# EAGLE design Prototipo_2X_DobleCapa (EAGLE 6.1)
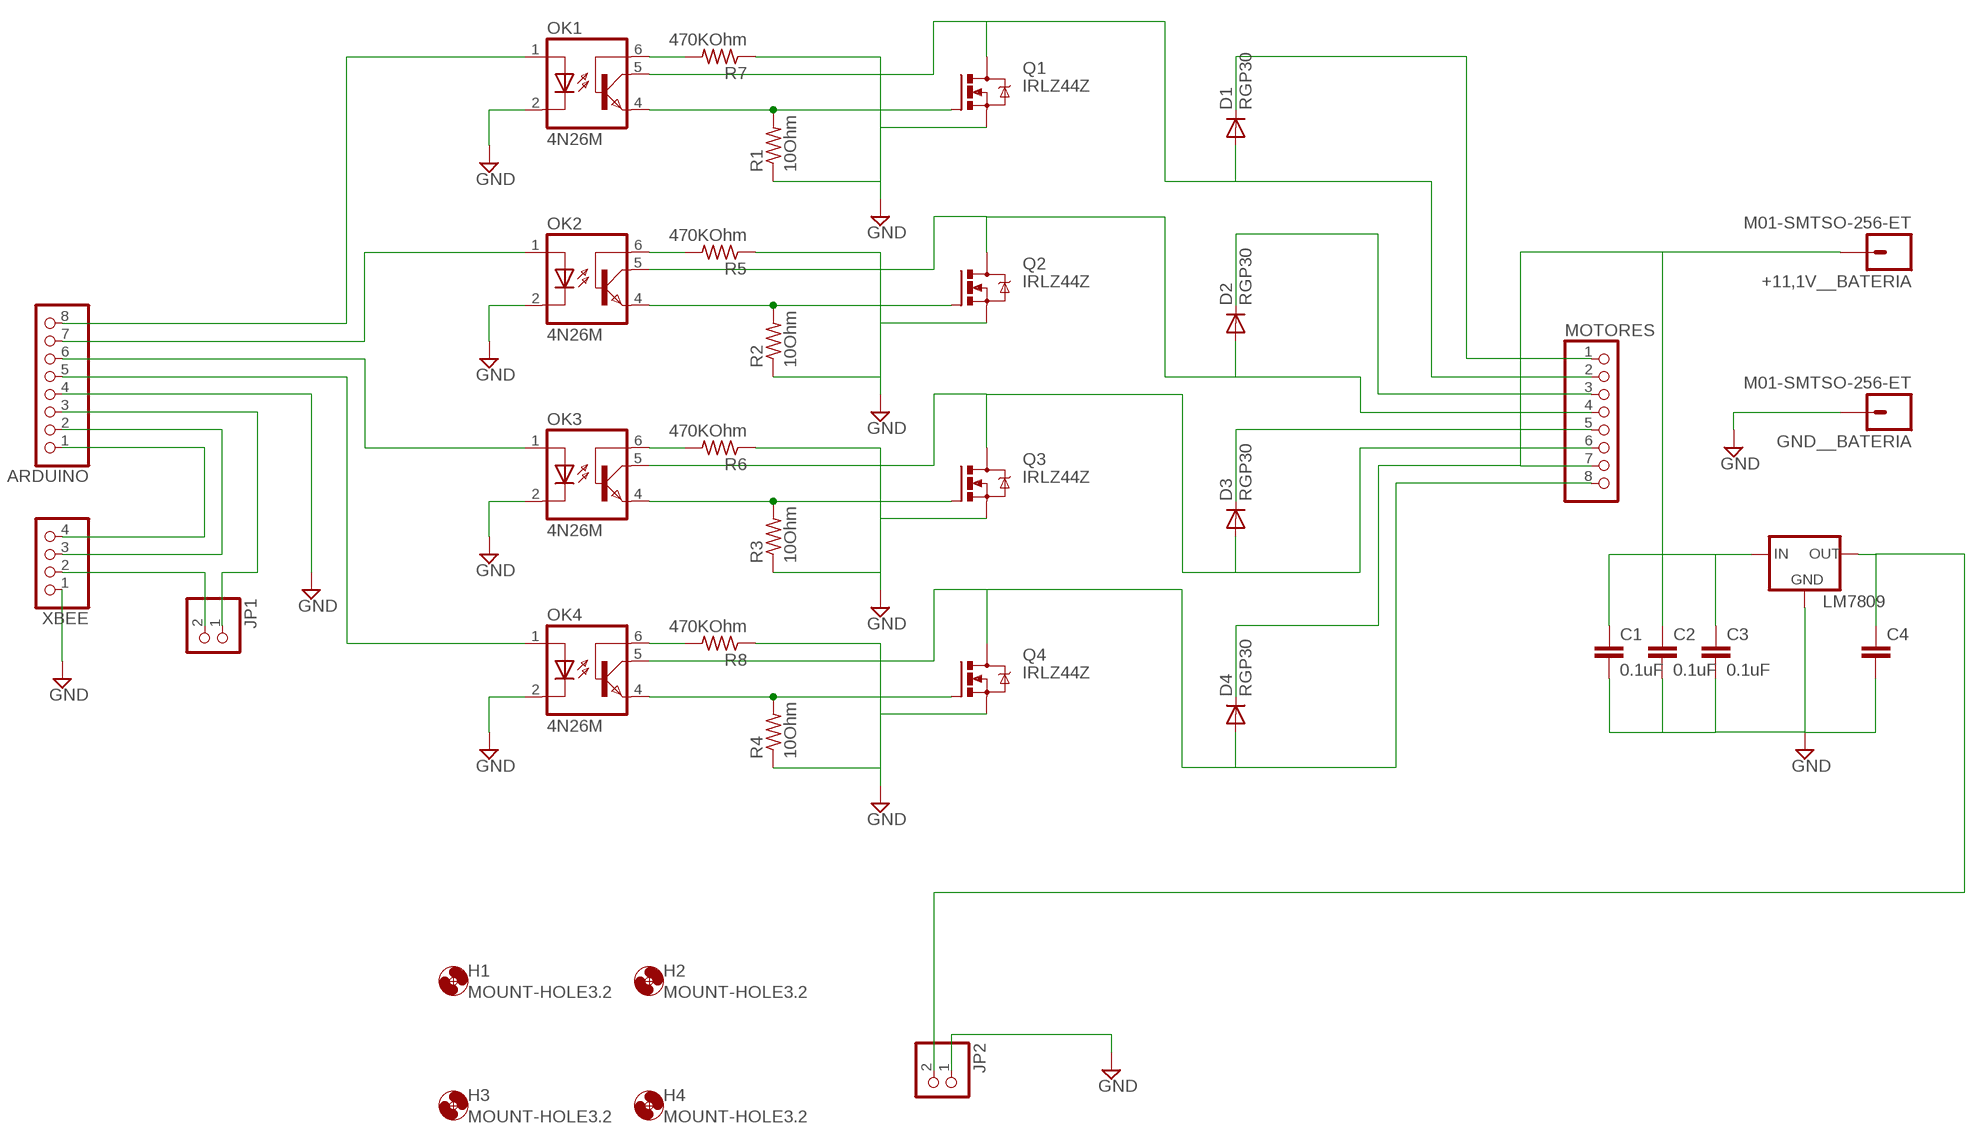
[diagram p0: schematic, sheet 1]

## Parts
+11,1V__BATERIA  M01-SMTSO-256-ET  [SMTSO-256-ET]
ARDUINO  PINHD-1X8/90  [1X08/90]
C1  0.1uF  0.1UF-50V-20%(PTH)KIT-EZ  [CAP-PTH-SMALL-KIT]
C2  0.1uF  0.1UF-50V-20%(PTH)KIT-EZ  [CAP-PTH-SMALL-KIT]
C3  0.1uF  0.1UF-50V-20%(PTH)KIT-EZ  [CAP-PTH-SMALL-KIT]
C4  0.1UF-50V-20%(PTH)KIT-EZ  [CAP-PTH-SMALL-KIT]
D1  RGP30  [DO201-15]
D2  RGP30  [DO201-15]
D3  RGP30  [DO201-15]
D4  RGP30  [DO201-15]
GND__BATERIA  M01-SMTSO-256-ET  [SMTSO-256-ET]
H1  MOUNT-HOLE3.2  [3,2]
H2  MOUNT-HOLE3.2  [3,2]
H3  MOUNT-HOLE3.2  [3,2]
H4  MOUNT-HOLE3.2  [3,2]
JP1  PINHD-1X2  [1X02]
JP2  PINHD-1X2/90  [1X02/90]
LM7809  78XXL  [78XXL]
MOTORES  PINHD-1X8/90  [1X08/90]
OK1  4N26M  [DIL06]
OK2  4N26M  [DIL06]
OK3  4N26M  [DIL06]
OK4  4N26M  [DIL06]
Q1  IRLZ44Z  [TO220BH]
Q2  IRLZ44Z  [TO220BH]
Q3  IRLZ44Z  [TO220BH]
Q4  IRLZ44Z  [TO220BH]
R1  10Ohm  R-US_0207/7  [0207/7]
R2  10Ohm  R-US_0207/7  [0207/7]
R3  10Ohm  R-US_0207/7  [0207/7]
R4  10Ohm  R-US_0207/7  [0207/7]
R5  470KOhm  R-US_0207/7  [0207/7]
R6  470KOhm  R-US_0207/7  [0207/7]
R7  470KOhm  R-US_0207/7  [0207/7]
R8  470KOhm  R-US_0207/7  [0207/7]
XBEE  PINHD-1X4  [1X04]

## Nets
GND [power]: ARDUINO.4 C1.2 C2.2 C3.2 C4.2 GND__BATERIA.P$1 JP2.1 LM7809.GND OK1.2(C) OK2.2(C) OK3.2(C) OK4.2(C) Q1.S Q2.S Q3.S Q4.S R1.1 R2.1 R3.1 R4.1 R5.1 R6.1 R7.1 R8.1 XBEE.1
N$1: ARDUINO.8 OK1.1(A)
N$2: ARDUINO.7 OK2.1(A)
N$3: ARDUINO.6 OK3.1(A)
N$4: ARDUINO.5 OK4.1(A)
N$5: ARDUINO.1 XBEE.4
N$6: OK1.6(BAS) R7.2
N$7: JP1.2 XBEE.2
N$8: OK1.4(EMI) Q1.G R1.2
N$9: OK2.4(EMI) Q2.G R2.2
N$10: OK3.4(EMI) Q3.G R3.2
N$11: OK4.4(EMI) Q4.G R4.2
N$12: +11,1V__BATERIA.P$1 C1.1 C2.1 C3.1 D1.C D2.C D3.C D4.C LM7809.IN MOTORES.1 MOTORES.3 MOTORES.5 MOTORES.7
N$13: ARDUINO.2 XBEE.3
N$14: D2.A MOTORES.4 OK2.5(COL) Q2.D
N$15: D3.A MOTORES.6 OK3.5(COL) Q3.D
N$16: D4.A MOTORES.8 OK4.5(COL) Q4.D
N$17: D1.A MOTORES.2 OK1.5(COL) Q1.D
N$18: C4.1 JP2.2 LM7809.OUT
N$19: OK2.6(BAS) R5.2
N$20: ARDUINO.3 JP1.1
N$21: OK3.6(BAS) R6.2
N$22: OK4.6(BAS) R8.2

## Library data of the parts
+11,1V__BATERIA GND__BATERIA = SparkFun-Connectors:M01: Header 1 Standard 1-pin 0.1" header. Use with straight break away headers (SKU : PRT-00116), right angle break away headers (PRT-00553), swiss pins (PRT-00743), machine pins (PRT-00117), and female headers (PRT-00115).
ARDUINO MOTORES = pinhead:PINHD-1X8: PIN HEADER
C1-C4 = SparkFun-Capacitors:0.1UF-50V-20%(PTH): CAP-08370; PROD_ID: CAP-08370
D1-D4 = diode:RGP30: DIODE fast-recovery rectifier
H1-H4 = holes:MOUNT-HOLE: MOUNTING HOLE with drill center marker
JP1 JP2 = pinhead:PINHD-1X2: PIN HEADER
LM7809 = v-reg:78XXL: VOLTAGE REGULATOR
OK1-OK4 = optocoupler:4N*?M: General Purpose 6-Pin Phototransistor Optocouplers Source: http://www.fairchildsemi.com/ds/4N/4N35-M.pdf; MPN: 4N26-M; OC_FARNELL: 1021350; OC_NEWARK: 98K9089
Q1-Q4 = transistor-power:IRLZ44Z: N-Channel HEXFET® Power MOSFET Logic Level AUTOMOTIVE MOSFET Source: http://www.irf.com/product-info/datasheets/data/irlz44zpbf.pdf
R1-R4 = rcl:R-US_: RESISTOR, American symbol
R5-R8 = resistor:R-US_: RESISTOR, American symbol
XBEE = pinhead:PINHD-1X4: PIN HEADER

## Net classes
0 default: clearance 0.205 mm
1 power: width 0.655 mm, drill 10.22 mm, clearance 0.205 mm to class 0, clearance 0.205 mm

## Board
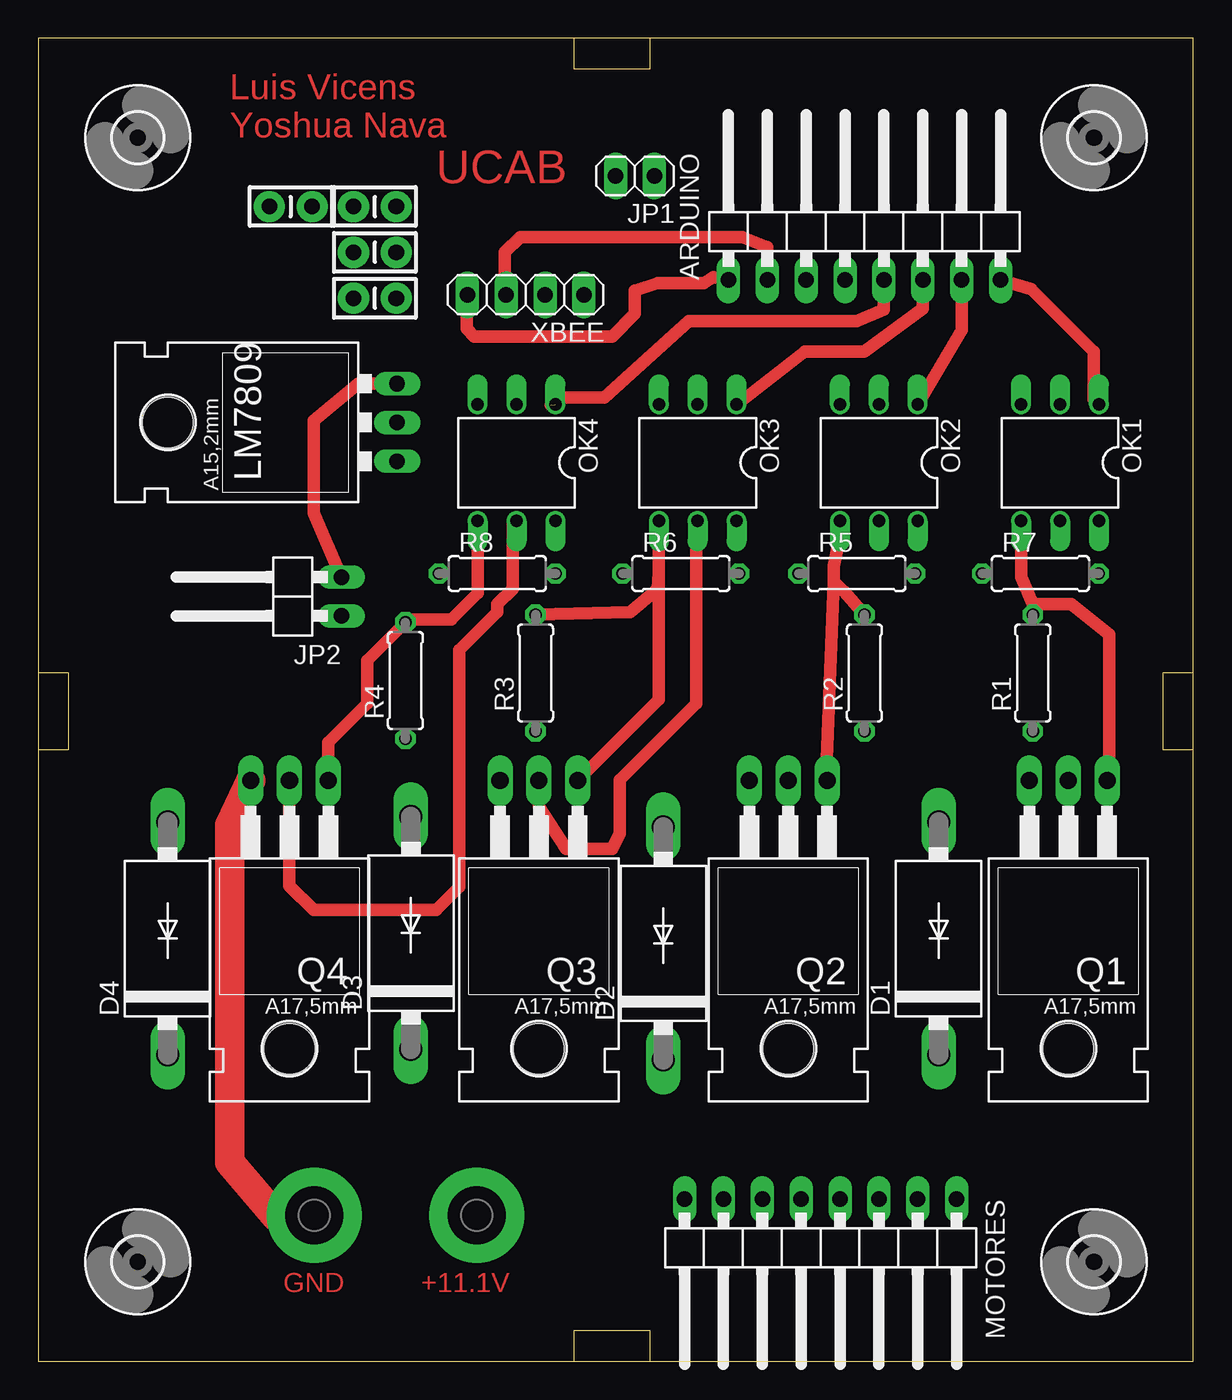
[diagram p1: board, top side]
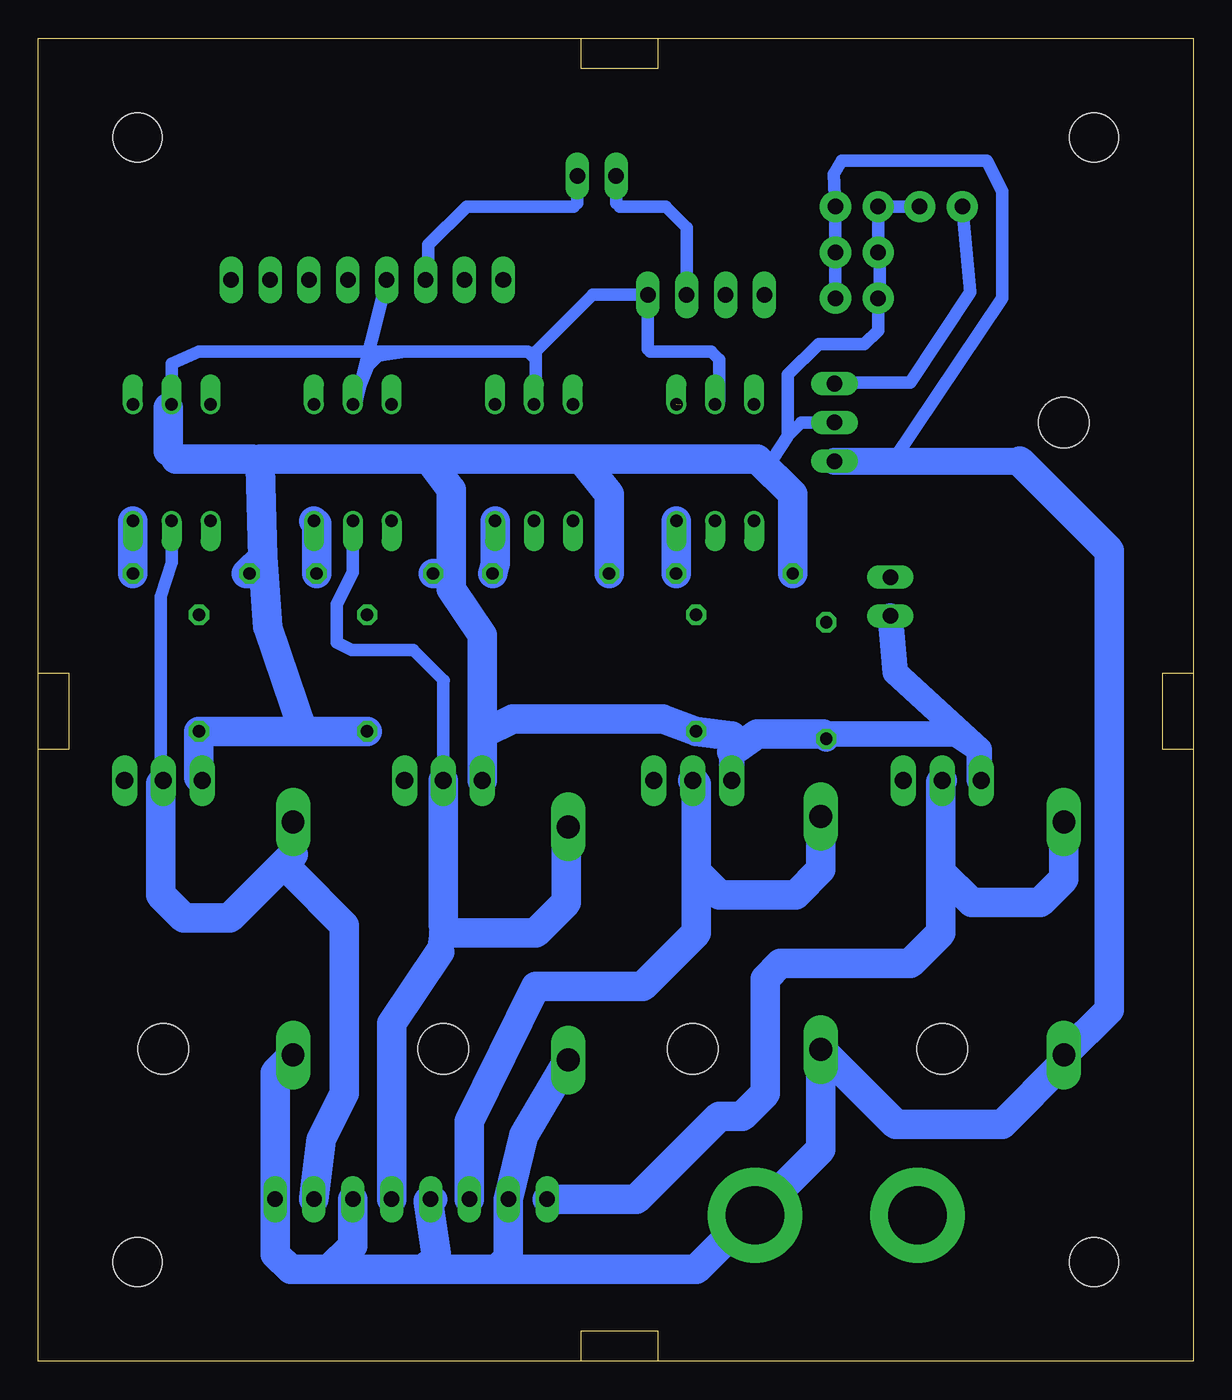
[diagram p2: board, bottom side, seen from below]

Size 75.5 x 86.5 mm. Coordinates in mm from the lower left corner, seen from the top.
Outline: 0,0 75.5,0 75.5,86.5 0,86.5 0,0
Copper layers (1*16): Top 0.035mm / dielectric 1.5mm / Bottom 0.035mm
Design rules: minimum track width 10mil, minimum drill 24mil, track to track 8mil, track to pad 8mil, pad to pad 8mil, via to via 8mil, smd to smd 8mil, copper to edge 40mil, drill to drill 8mil, minimum pad ring 10mil, minimum via ring 8mil, stop-mask expansion 4mil, vias tented up to drill 0mil, thermal gap 10mil

### Footprints (pad centres in the part's own frame; a part is rotated, then mirrored left to right if it is on the bottom)
SMTSO-256-ET = drill 3.81 pad 6.198: P$1 0,0
1X08/90 = drill 1.016 long: 1 -8.89,-3.81; 2 -6.35,-3.81; 3 -3.81,-3.81; 4 -1.27,-3.81; 5 1.27,-3.81; 6 3.81,-3.81; 7 6.35,-3.81; 8 8.89,-3.81
CAP-PTH-SMALL-KIT = drill 1.016 pad 2.032: 1 -1.397,0; 2 1.397,0
DO201-15 = drill 1.499 long: A 7.62,0; C -7.62,0
3,2 = hole 3.2: 0,0
1X02 = drill 1.016 long: 1 -1.27,0; 2 1.27,0
1X02/90 = drill 1.016 long: 1 -1.27,-3.81; 2 1.27,-3.81
78XXL = drill 1.016 long: GND 0,-3.81; IN -2.54,-3.81; OUT 2.54,-3.81 | hole 3.302: 0,11.176
DIL06 = drill 0.813 offset: 1 -2.54,-3.81; 2 0,-3.81; 3 2.54,-3.81; 4 2.54,3.81; 5 0,3.81; 6 -2.54,3.81
TO220BH = drill 1.118 long: D 0,-6.35; G -2.54,-6.35; S 2.54,-6.35 | hole 3.302: 0,11.176
0207/7 = drill 0.813 octagon: 1 -3.81,0; 2 3.81,0
1X04 = drill 1.016 long: 1 -3.81,0; 2 -1.27,0; 3 1.27,0; 4 3.81,0

### Placement (x,y rotation side)
+11,1V__BATERIA  28.66,9.54 0 top
ARDUINO  54,74.5 0 top
C1  22,72.5 180 top
C2  22,75.5 180 top
C3  22,69.5 180 top
C4  16.5,75.5 0 top
D1  58.85,27.64 90 top
D2  40.85,27.32 90 top
D3  24.35,28 90 top
D4  8.46,27.64 90 top
GND__BATERIA  18.04,9.54 0 top
H1  6.5,6.5 0 top
H2  6.5,80 0 top
H3  69,6.5 0 top
H4  69,80 0 top
JP1  39,77.5 180 top
JP2  16,50 90 top
LM7809  19.65,61.38 90 top
MOTORES  51.13,6.78 180 top
OK1  66.78,58.75 180 top
OK2  54.94,58.75 180 top
OK3  43.1,58.75 180 top
OK4  31.26,58.75 180 top
Q1  67.32,31.61 180 top
Q2  49.02,31.61 180 top
Q3  32.72,31.61 180 top
Q4  16.42,31.61 180 top
R1  1KOhm  [0207/7]  65,45 90 top
R2  1KOhm  [0207/7]  54,45 90 top
R3  1KOhm  [0207/7]  32.5,45 90 top
R4  1KOhm  [0207/7]  24,44.5 90 top
R5  53.5,51.5 0 top
R6  42,51.5 0 top
R7  65.5,51.5 0 top
R8  30,51.5 0 top
XBEE  31.85,69.73 180 top

### Tracks (layer width: path | path; a pad name or v marks a point on that pad's centre or on a via)
GND
  Top 1.93: GND__BATERIA.P$1 15.54,9.46 12.5,13 12.5,35.08 Q4.S
  Bottom 0.813: 43,65.5 43,66 39.27,69.73 XBEE.1 35.66,66.16 35.5,66 31.5,66 31,65.5 31,62.82 OK4.2 | 43,65.5 43,62.66 OK3.2 | 53.25,65.75 53.94,65.06 OK2.2 54.73,62.77 ARDUINO.4 | 53.25,65.75 53,66 | 53,66 51.5,66 | 51.5,66 43.5,66 43,65.5 | 53,66 65,66 66.78,65.22 OK1.2 67,62.34 | 51.5,66 53.25,65.75 | C4.2 C2.2 C1.2 20.5,72.5 20.5,70.6 C3.2 20.6,67.4 21.5,66.5 24.5,66.5 26.5,64.5 26.5,60.5 | 61,58.5 61.25,58.75 | 61.25,58.75 61.5,59 | 61,59 61.25,58.75 | 26.5,60.5 27.5,59 28.5,59 | LM7809.GND 25.62,61.38 26.5,60.5
  Bottom 1.27: 30.18,40.87 30.18,39.82 | 24.19,41 R4.1
  Bottom 1.676: Q3.S 30.18,40.87 | 66.5,59 67,59.5 | 65,38.18 Q1.S | Q4.S 13.96,37.96 14,38 14,40 | 14,40 19.5,45.04 JP2.1 | 14,40 15.5,41 23.81,41 R4.1
  Bottom 1.93: R2.1 58.19,41.19 | 58.19,41.19 R1.1 65,38.18 | 30.18,40.87 R3.1 34.69,42 44.5,42 46.48,41.02 | 30.18,39.82 28.5,41 24.19,41 | Q2.S 46.48,41.02 | 58.19,41.19 60.5,48 60.84,52.56 | 60.84,52.56 61,58.5 | 61.5,59 66.5,59 | 67,59.5 67,62.34 | 46.48,41.02 46.48,47.48 48.5,50.5 48.5,51 | 48.5,51 48.5,57 50,59 | 50,59 61,59 | R7.1 61.9,51.5 60.84,52.56 | R5.1 49,51.5 48.5,51 | R6.1 38.19,56.69 40,59 | 40,59 50,59 | R8.1 26.19,56.69 28.5,59 40,59
N$1
  Top 0.813: ARDUINO.8 64.89,70.11 69,66 69,62.88 OK1.1
N$2
  Top 0.813: ARDUINO.7 60.35,67.43 OK2.1
N$3
  Top 0.813: ARDUINO.6 57.81,68.81 54,66 50.08,66 OK3.1
N$4  (1 unrouted)
  Top 0.813: ARDUINO.5 55.27,68.77 53.5,68 42.5,68 37,63 34,63 33.5,62.5
N$5
  Top 0.813: ARDUINO.1 44.11,70.89 43.5,70.5 40.5,70.5 39,70 39,68.5 37.5,67 28.5,67 28,67.5 28,69.69 XBEE.4
N$6
  Bottom 1.93: R7.2 OK1.6
N$7
  Bottom 0.813: XBEE.2 33.12,74.12 34.5,75.5 37.5,75.5 37.73,75.73 JP1.2
N$8
  Top 0.813: OK1.4 64.24,51.26 65,49.5 | 65,49.5 67.5,49.5 70,47.5 70,38.1 Q1.G | R1.2 65,49.5
N$9
  Top 0.813: OK2.4 52.4,53.9 52,52 52,51 | 52,51 51.5,38.52 Q2.G | R2.2 52.69,50.31 52,51
N$10
  Top 0.813: 40.56,51.56 40.56,43.26 Q3.G | OK3.4 40.56,51.56 | 40.56,51.56 40.5,50.5 38.69,49 R3.2
N$11
  Top 0.813: Q4.G 18.96,40.46 21.5,43 21.5,45.81 R4.2 24.19,48.5 27,48.5 28.72,50.22 OK4.4
N$12
  Bottom 0.813: C3.1 C1.1 C2.1 23.5,77.6 23,78.5 13.5,78.5 12.5,76.5 12.5,69.5 19.66,58.84
  Bottom 1.27: 60,10.57 MOTORES.1 | 49.59,10.59 50,10.5
  Bottom 1.676: MOTORES.5 49.59,10.59 | 49.5,7 50.5,6
  Bottom 1.778: LM7809.IN 19.66,58.84 11.34,58.84
  Bottom 1.93: MOTORES.1 60.02,18.85 D1.C | MOTORES.3 54.94,7.56 56.5,6 | 56.5,6 59,6 60,7 60,10.57 | 50,10.5 49.5,7 | 56.5,6 50.5,6 45.5,6 | 45.5,6 44.78,6.72 MOTORES.7 43.78,14.77 D2.C | 11.34,58.84 5.5,53 5.5,22.98 D4.C 8.46,19.54 12.5,15.5 19.47,15.5 D3.C 24.35,13.85 +11,1V__BATERIA.P$1 28.96,9.54 32.5,6 45.5,6
N$13
  Top 0.813: ARDUINO.2 47.65,72.85 46,73.5 31.5,73.5 30.5,72.5 30.5,69.81 XBEE.3
N$14
  Bottom 0.813: OK2.5 54.94,51.56 56,49.5 56,47 55,46.5 51,46.5 49,44.5 49.02,44.48 Q2.D
  Bottom 1.27: 49.25,26.75 49,28 | 41,34.79 D2.A
  Bottom 1.676: 49.02,28.52 49.25,26.75
  Bottom 1.93: MOTORES.4 52.4,22.1 49.25,26.75 | 49,28 43,28 41,30 41,34.79 | Q2.D 49.02,28.52
N$15
  Top 0.813: Q3.D 32.72,36.28 34.5,33.5 37.5,33.5 38,34.5 38,38 43,43 43,54.84 OK3.5
  Bottom 1.93: D3.A 24.35,32.15 26,30.5 31,30.5 32.5,32 | 32.5,32 32.5,37.74 Q3.D | MOTORES.6 47.32,15.68 43,24.5 36,24.5 32.5,28 32.5,32
N$16
  Top 0.813: Q4.D 16.42,31.08 18,29.5 26,29.5 27.5,31 27.5,46.5 30,49 30,49.5 31,50.5 31,54.68 OK4.5
  Bottom 1.93: D4.A 8.46,31.54 10,30 14.5,30 16.5,32 | 16.5,32 16.5,37.88 Q4.D | MOTORES.8 36.41,10.59 31,16 29.5,16 28,17.5 28,25 27,26 18.5,26 16.5,28 16.5,32
N$17
  Bottom 0.813: OK1.5 66.78,52.22 67.5,50 67.5,38.14 Q1.D
  Bottom 1.27: 58.85,31.85 D1.A 58.85,33.15 | 67.5,37.78 Q1.D
  Bottom 1.93: 58.85,31.85 55.5,28.5 55.5,17.5 57,14.5 57.5,10.61 MOTORES.2 | 58.85,33.15 63,29 66,29 67.5,30.5 67.5,37.78
N$18
  Top 0.813: LM7809.OUT 20.92,63.92 18,61.5 18,55.46 JP2.2
  Bottom 0.813: C4.1 14.6,69.9 18.5,64 23.38,64 LM7809.OUT
N$19
  Bottom 1.93: R5.2 57.31,54.77 OK2.6
N$20
  Bottom 0.813: JP1.1 40.27,75.73 40.5,75.5 47.5,75.5 50,73 50,70.88 ARDUINO.3
N$21
  Bottom 1.93: OK3.6 45.64,52.17 R6.2
N$22
  Bottom 1.93: R8.2 OK4.6

### Text on the board
Top: Luis Vicens | Yoshua Nava | UCAB | GND | +11.1V